# Altium schematic sheet P06-Audio.SchDoc
size 420 x 297 mm
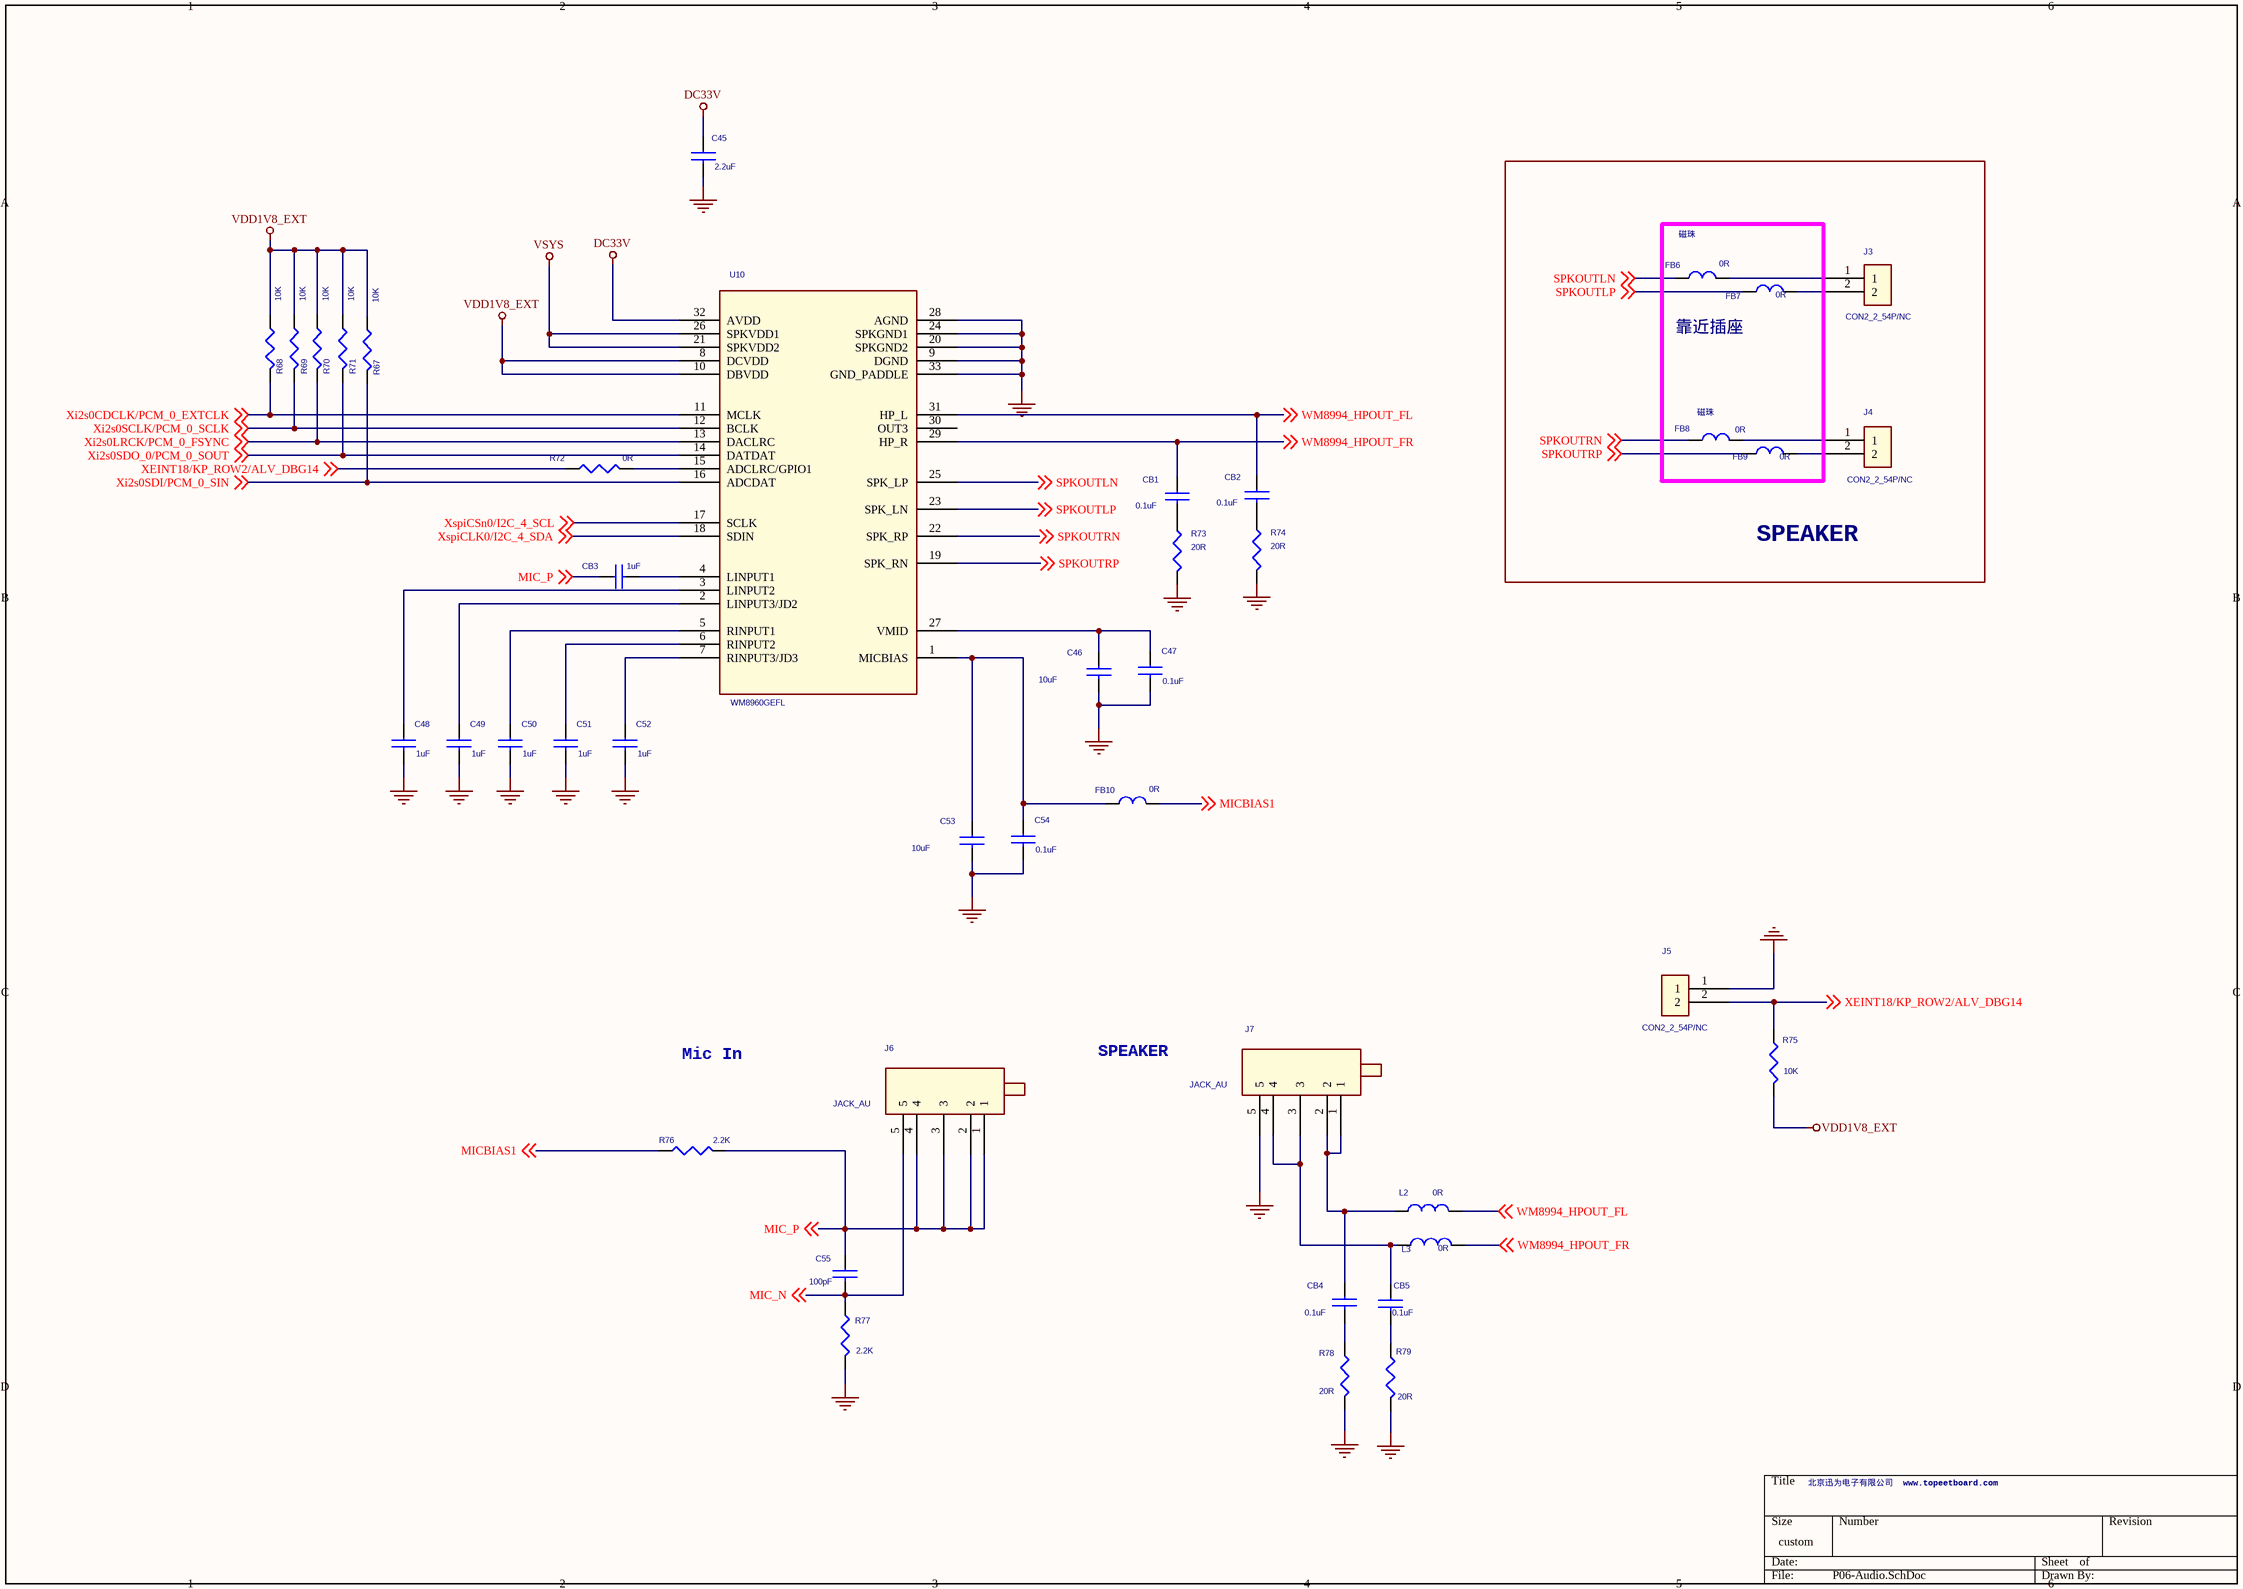
[diagram p0: P06-Audio.SchDoc]

## Parts
C45  2.2uF  [C0603]
C46  10uF  [C0603]
C47  0.1uF  [C0603]
C48  1uF  [C0603]
C49  1uF  [C0603]
C50  1uF  [C0603]
C51  1uF  [C0603]
C52  1uF  [C0603]
C53  10uF  [C0603]
C54  0.1uF  [C0603]
C55  100pF  [C1608]
CB1  0.1uF  [C1608]
CB2  0.1uF  [C1608]
CB3  1uF  [C1608]
CB4  0.1uF  [C1608]
CB5  0.1uF  [C1608]
FB6  0R  [1206-A]
FB7  0R  [1206-A]
FB8  0R  [1206-A]
FB9  0R  [1206-A]
FB10  0R  [1206-A]
J3  CON2_2_54P/NC  [a4b-2pa-2_54dsa]
J4  CON2_2_54P/NC  [a4b-2pa-2_54dsa]
J5  CON2_2_54P/NC  [a4b-2pa-2_54dsa]
J6  JACK_AU  [ear_jack]
J7  JACK_AU  [ear_jack]
L2  0R  [LQH32C]
L3  0R  [LQH32C]
R67  10K  [R0402]
R68  10K  [R0402]
R69  10K  [R0402]
R70  10K  [R0402]
R71  10K  [R0402]
R72  0R  [R0402]
R73  20R  [R1005]
R74  20R  [R1005]
R75  10K  [R1005]
R76  2.2K  [R1005]
R77  2.2K  [R1005]
R78  20R  [R1005]
R79  20R  [R1005]
U10  WM8960GEFL  [QFN32-050-5X5LH]

## Blocks framed on the sheet
SPEAKER: J3 J4
靠近插座: FB6-FB9

## Nets
DC33V: C45.1 U10.32(AVDD)
GND: C45.2 C46.2 C47.2 C48.2 C49.2 C50.2 C51.2 C52.2 C53.2 C54.2 J5.1 J7.5 R73.2 R74.2 R77.2 R78.2 R79.2 U10.9(DGND) U10.20(SPKGND2) U10.24(SPKGND1) U10.28(AGND) U10.33(GND_PADDLE)
VDD1V8_EXT: R67.1 R68.1 R69.1 R70.1 R71.1 R75.2 U10.8(DCVDD) U10.10(DBVDD)
VSYS: U10.21(SPKVDD2) U10.26(SPKVDD1)
MIC_N: C55.2 J6.5 R77.1 ; off-sheet MIC_N
MIC_P: C55.1 CB3.1 J6.1 J6.2 J6.3 J6.4 R76.2 ; off-sheet MIC_P
MICBIAS1: FB10.2 R76.1 ; off-sheet MICBIAS1
SPKOUTLN: FB6.1 U10.25(SPK_LP) ; off-sheet SPKOUTLN
SPKOUTLP: FB7.1 U10.23(SPK_LN) ; off-sheet SPKOUTLP
SPKOUTRN: FB8.1 U10.22(SPK_RP) ; off-sheet SPKOUTRN
SPKOUTRP: FB9.1 U10.19(SPK_RN) ; off-sheet SPKOUTRP
WM8994_HPOUT_FL: CB2.1 L2.2 U10.31(HP_L) ; off-sheet WM8994_HPOUT_FL
WM8994_HPOUT_FR: CB1.1 L3.2 U10.29(HP_R) ; off-sheet WM8994_HPOUT_FR
XEINT18/KP_ROW2/ALV_DBG14: J5.2 R72.1 R75.1 ; off-sheet XEINT18/KP_ROW2/ALV_DBG14
Xi2s0CDCLK/PCM_0_EXTCLK: R68.2 U10.11(MCLK) ; off-sheet Xi2s0CDCLK/PCM_0_EXTCLK
Xi2s0LRCK/PCM_0_FSYNC: R70.2 U10.13(DACLRC) ; off-sheet Xi2s0LRCK/PCM_0_FSYNC
Xi2s0SCLK/PCM_0_SCLK: R69.2 U10.12(BCLK) ; off-sheet Xi2s0SCLK/PCM_0_SCLK
Xi2s0SDI/PCM_0_SIN: R67.2 U10.16(ADCDAT) ; off-sheet Xi2s0SDI/PCM_0_SIN
Xi2s0SDO_0/PCM_0_SOUT: R71.2 U10.14(DATDAT) ; off-sheet Xi2s0SDO_0/PCM_0_SOUT
XspiCLK0/I2C_4_SDA: U10.18(SDIN) ; off-sheet XspiCLK0/I2C_4_SDA
XspiCSn0/I2C_4_SCL: U10.17(SCLK) ; off-sheet XspiCSn0/I2C_4_SCL
NetC46_1: C46.1 C47.1 U10.27(VMID)
NetC48_1: C48.1 U10.3(LINPUT2)
NetC49_1: C49.1 U10.2(LINPUT3/JD2)
NetC50_1: C50.1 U10.5(RINPUT1)
NetC51_1: C51.1 U10.6(RINPUT2)
NetC52_1: C52.1 U10.7(RINPUT3/JD3)
NetC53_1: C53.1 C54.1 FB10.1 U10.1(MICBIAS)
NetCB1_2: CB1.2 R73.1
NetCB2_2: CB2.2 R74.1
NetCB3_2: CB3.2 U10.4(LINPUT1)
NetCB4_1: CB4.1 J7.1 J7.2 L2.1
NetCB4_2: CB4.2 R78.1
NetCB5_1: CB5.1 J7.3 J7.4 L3.1
NetCB5_2: CB5.2 R79.1
NetFB6_2: FB6.2 J3.1
NetFB7_2: FB7.2 J3.2
NetFB8_2: FB8.2 J4.1
NetFB9_2: FB9.2 J4.2
NetR72_2: R72.2 U10.15(ADCLRC/GPIO1)

Not connected (* = marked no-connect by the designer): U10 30(OUT3)

## Notes on the sheet
- (near FB6) 磁珠
- (near FB8) 磁珠
- Mic In
- SPEAKER
- 北京迅为电子有限公司  www.topeetboard.com

## Library data of the parts
C45-C54 = C0603_0
C55 = C1608
CB1-CB5 = C1608_Dup2
FB6-FB10 = FB1206_0
J3 J4 = CON2_2_54P
J5 = CON2-2_54P
L2 L3 = LQH32C_0_Dup1
R67-R72 = R_Dup1
R73-R79 = R1005_0
U10 = WM8960GEFL_0